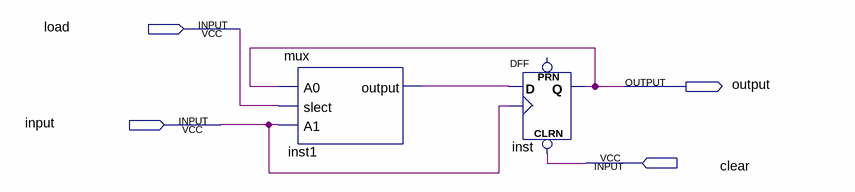
[diagram p0: schematic sheet]
// Quartus schematic loadDff.bdf as structural Verilog: 2 symbols, 4 pins
module loadDff (
  input  load,
  input  \input ,
  input  clear,
  output \output 
);

  wire inst1_output;

  mux inst1 (.A0(\output ), .slect(load), .A1(\input ), .\output (inst1_output));
  DFF inst (.CLRN(clear), .CLK(\input ), .D(inst1_output), .Q(\output ));  // open: PRN
endmodule
